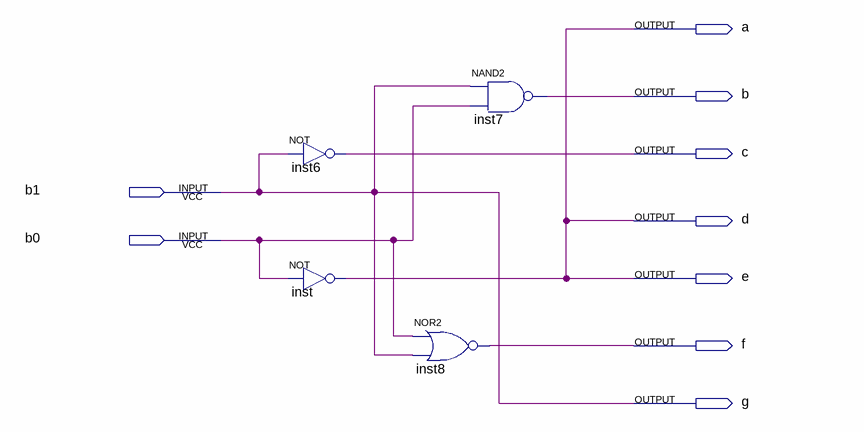
[diagram p0: schematic sheet]
// Quartus schematic WhoWonTo7Segment.bdf as structural Verilog: 4 symbols, 9 pins
module WhoWonTo7Segment (
  input  b1,
  input  b0,
  output a,
  output b,
  output c,
  output d,
  output e,
  output f,
  output g
);

  not inst6 (c, b1);
  not inst (a, b0);
  nor inst8 (f, b0, b1);
  nand inst7 (b, b1, b0);

  assign d = a;
  assign e = a;
  assign g = b1;
endmodule
